# EAGLE design Sensorino-SMD (EAGLE 6.4)
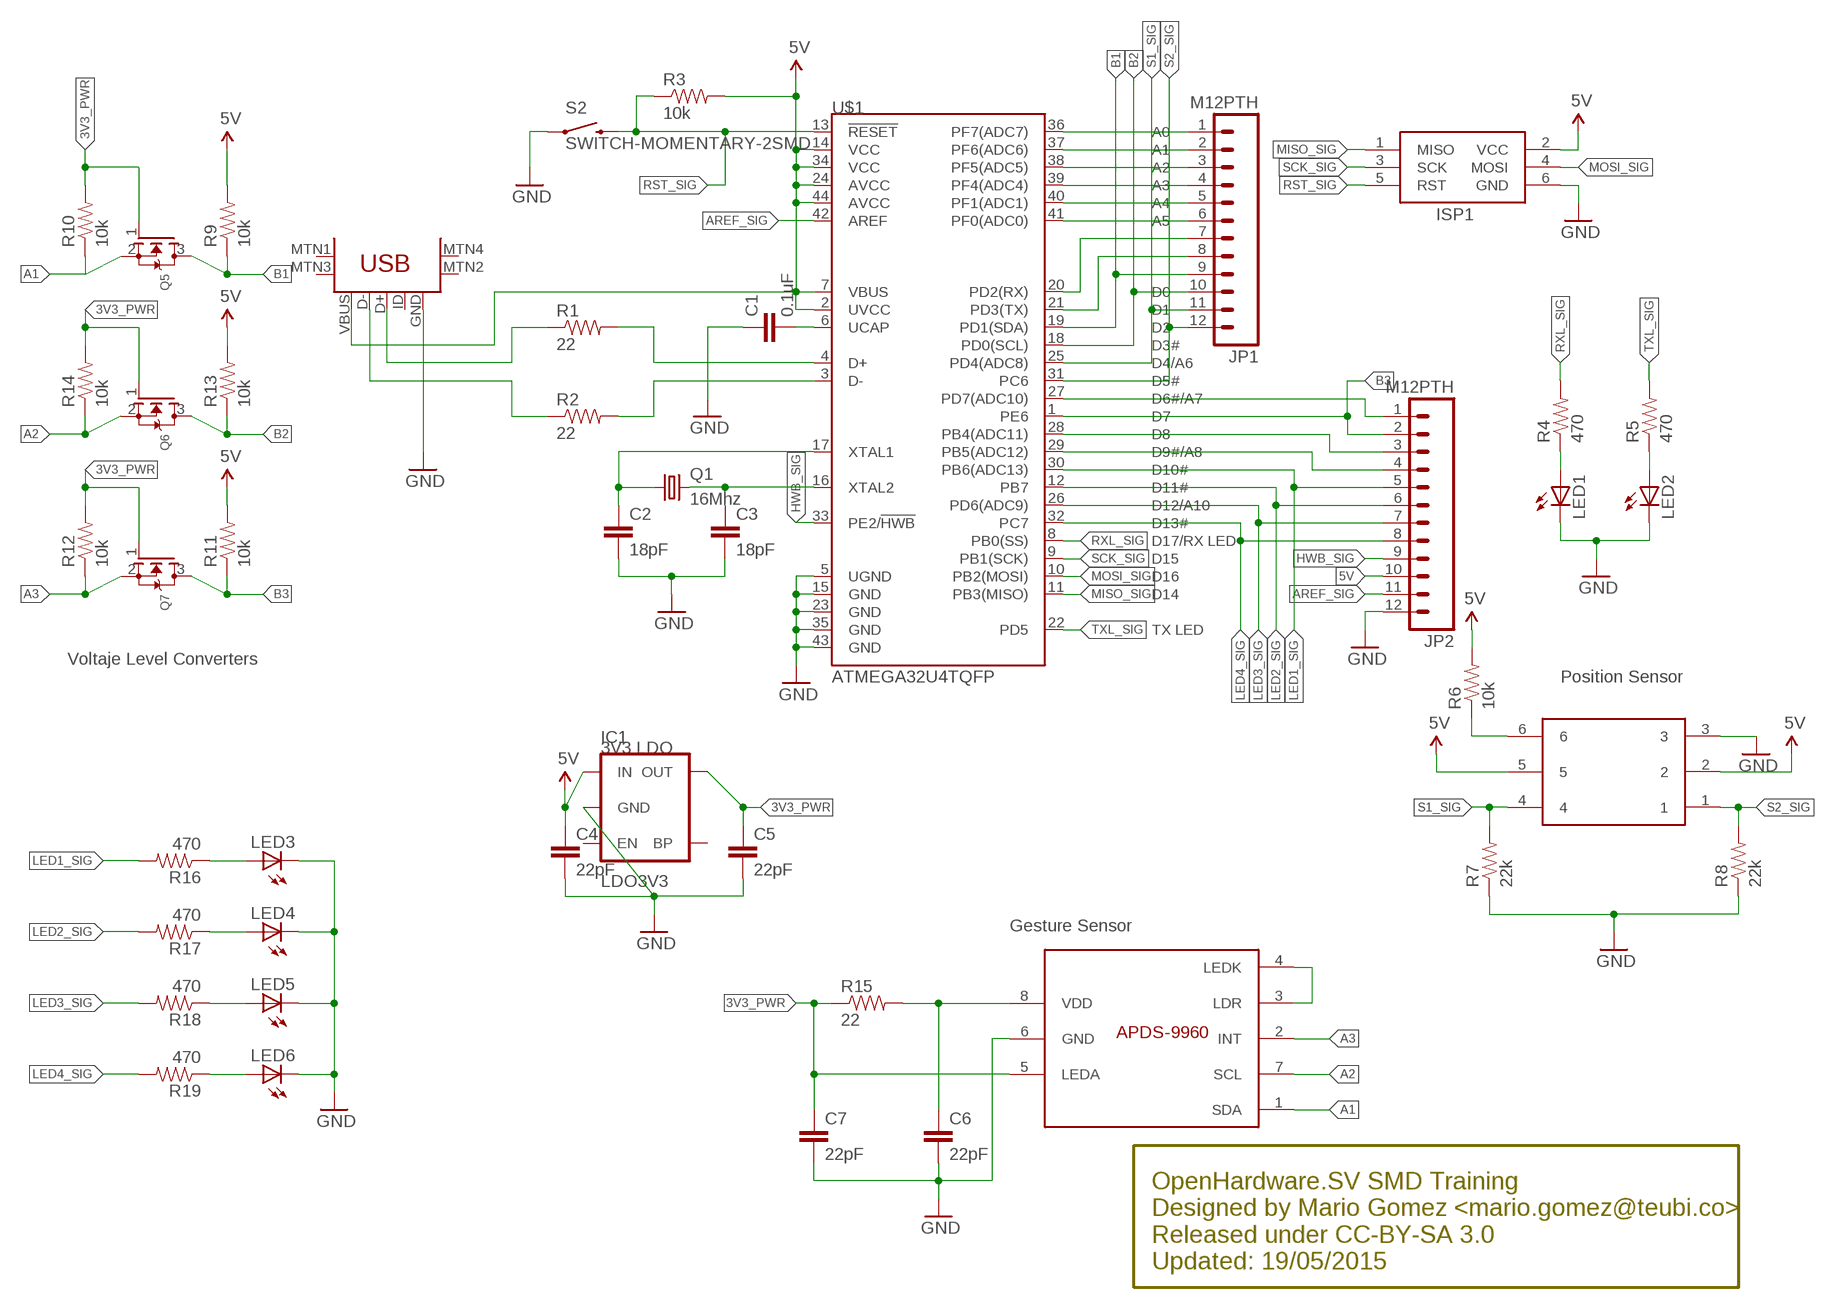
[diagram p0: schematic, sheet 1]

## Parts
C1  0.1uF  CAP0805  [0805]
C2  18pF  CAP0805  [0805]
C3  18pF  CAP0805  [0805]
C4  22pF  CAP0805  [0805]
C5  22pF  CAP0805  [0805]
C6  22pF  CAP0805  [0805]
C7  22pF  CAP0805  [0805]
IC1  LDO3V3  MIC52053.3V  [SOT23-5]
ISP1  AVRISP-6  [AVRISP]
JP1  M12PTH  [1X12]
JP2  M12PTH  [1X12]
LED1  LED-WHITE  [LED-1206]
LED2  LED-WHITE  [LED-1206]
LED3  LED-WHITE  [LED-1206]
LED4  LED-WHITE  [LED-1206]
LED5  LED-WHITE  [LED-1206]
LED6  LED-WHITE  [LED-1206]
Q1  16Mhz  CRYSTALCTS406  [CTS406]
Q5  MOSFET-NREFLOW  [SOT23]
Q6  MOSFET-NREFLOW  [SOT23]
Q7  MOSFET-NREFLOW  [SOT23]
R1  22  RESISTOR0805-RES  [0805]
R2  22  RESISTOR0805-RES  [0805]
R3  10k  RESISTOR0805-RES  [0805]
R4  470  RESISTOR0805-RES  [0805]
R5  470  RESISTOR0805-RES  [0805]
R6  10k  RESISTOR0805-RES  [0805]
R7  22k  RESISTOR0805-RES  [0805]
R8  22k  RESISTOR0805-RES  [0805]
R9  10k  RESISTOR0805-RES  [0805]
R10  10k  RESISTOR0805-RES  [0805]
R11  10k  RESISTOR0805-RES  [0805]
R12  10k  RESISTOR0805-RES  [0805]
R13  10k  RESISTOR0805-RES  [0805]
R14  10k  RESISTOR0805-RES  [0805]
R15  22  RESISTOR0805-RES  [0805]
R16  470  RESISTOR0805-RES  [0805]
R17  470  RESISTOR0805-RES  [0805]
R18  470  RESISTOR0805-RES  [0805]
R19  470  RESISTOR0805-RES  [0805]
S2  SWITCH-MOMENTARY-2SMD  [TACTILE_SWITCH_SMD]
U$1  ATMEGA32U4TQFP  [SPARKFUN-DIGITALIC_TQFP44]
U$2  USB-MINIB-5PIN  [USB-MINIB]
U$3  RPI-1031  [RPI-1031]
U$4  APDS-9960  [APDS-9960]

## Nets
3V3_PWR: C5.1 C7.1 IC1.5(OUT) Q5.1(G) Q6.1(G) Q7.1(G) R10.2 R12.2 R14.2 R15.1 U$4.5(LEDA)
5V: C4.1 IC1.1(IN) ISP1.2(VCC) JP2.10 R3.2 R6.2 R9.2 R11.2 R13.2 U$1.2(UVCC) U$1.7(VBUS) U$1.14(VCC) U$1.24(AVCC) U$1.34(VCC) U$1.44(AVCC) U$2.VBUS U$3.2 U$3.5
A1: Q5.2(S) R10.1 U$4.1(SDA)
A2: Q6.2(S) R14.1 U$4.7(SCL)
A3: Q7.2(S) R12.1 U$4.2(INT)
AREF_SIG: JP2.11 U$1.42(AREF)
B1: JP1.9 Q5.3(D) R9.1 U$1.19(PD1(SDA))
B2: JP1.10 Q6.3(D) R13.1 U$1.18(PD0(SCL))
B3: JP2.2 Q7.3(D) R11.1 U$1.1(PE6)
D_USBD+: R2.1 U$2.D-
D_USBD-: R1.1 U$2.D+
D_USBRD+: R2.2 U$1.3(D-)
D_USBRD-: R1.2 U$1.4(D+)
GND: C1.1 C2.2 C3.2 C4.2 C5.2 C6.2 C7.2 IC1.2(GND) ISP1.6(GND) JP2.12 LED1.C LED2.C LED3.C LED4.C LED5.C LED6.C R7.1 R8.1 S2.1 U$1.5(UGND) U$1.15(GND) U$1.23(GND) U$1.35(GND) U$1.43(GND) U$2.GND U$3.3 U$4.6(GND)
HWB_SIG: JP2.9 U$1.33(PE2/!HWB)
LED1_SIG: JP2.5 R16.2 U$1.30(PB6(ADC13))
LED2_SIG: JP2.6 R17.2 U$1.12(PB7)
LED3_SIG: JP2.7 R18.2 U$1.26(PD6(ADC9))
LED4_SIG: JP2.8 R19.2 U$1.32(PC7)
MISO_SIG: ISP1.1(MISO) U$1.11(PB3(MISO))
MOSI_SIG: ISP1.4(MOSI) U$1.10(PB2(MOSI))
N$5: JP2.1 U$1.27(PD7(ADC10))
N$6: C1.2 U$1.6(UCAP)
N$7: C3.1 Q1.3 U$1.16(XTAL2)
N$8: C2.1 Q1.1 U$1.17(XTAL1)
N$9: LED3.A R16.1
N$10: JP2.3 U$1.28(PB4(ADC11))
N$11: LED1.A R4.1
N$12: LED2.A R5.1
N$13: JP1.1 U$1.36(PF7(ADC7))
N$14: JP1.2 U$1.37(PF6(ADC6))
N$15: JP1.3 U$1.38(PF5(ADC5))
N$16: JP1.4 U$1.39(PF4(ADC4))
N$17: JP1.5 U$1.40(PF1(ADC1))
N$18: JP1.6 U$1.41(PF0(ADC0))
N$19: JP1.7 U$1.20(PD2(RX))
N$20: JP1.8 U$1.21(PD3(TX))
N$21: LED4.A R17.1
N$22: LED5.A R18.1
N$23: LED6.A R19.1
N$25: JP2.4 U$1.29(PB5(ADC12))
N$30: R6.1 U$3.6
N$31: U$4.3(LDR) U$4.4(LEDK)
N$32: C6.1 R15.2 U$4.8(VDD)
RST_SIG: ISP1.5(RST) R3.1 S2.3 U$1.13(!RESET)
RXL_SIG: R4.2 U$1.8(PB0(SS))
S1_SIG: JP1.11 R7.2 U$1.25(PD4(ADC8)) U$3.4
S2_SIG: JP1.12 R8.2 U$1.31(PC6) U$3.1
SCK_SIG: ISP1.3(SCK) U$1.9(PB1(SCK))
TXL_SIG: R5.2 U$1.22(PD5)
Unconnected: IC1.3(EN) IC1.4(BP) U$2.ID U$2.MTN1(MTN2) U$2.MTN2(MTN3) U$2.MTN3(MTN1) U$2.MTN4

## Notes on the sheet
- Voltaje Level Converters
- Position Sensor
- 3V3 LDO
- Gesture Sensor
- OpenHardware.SV SMD Training
  Designed by Mario Gomez <mario.gomez@teubi.co>
  Released under CC-BY-SA 3.0
  Updated: 19/05/2015

## Library data of the parts
C1-C7 = SparkFun-Capacitors:CAP: Capacitor Standard 0603 ceramic capacitor, and 0.1" leaded capacitor.
IC1 = SparkFun-PowerIC:MIC5205: MIC5205 150mA vreg 3.3V - VREG-00822 5V - VREG-00823; PROD_ID: VREG-00822
ISP1 = adafruit:AVRISP: AVR ISP HEADER Standard 6 pin header for AVR programming
JP1 JP2 = SparkFun-Connectors:M12: Header 12 Standard 12-pin 0.1" header. Use with straight break away headers (SKU : PRT-00116), right angle break away headers (PRT-00553), swiss pins (PRT-00743), machine pins (PRT-00117), and female headers (PRT-00115).
LED1-LED6 = SparkFun-LED:LED-WHITE: White SMD LEDs LilyPad 1206- DIO-09955; PROD_ID: DIO-09955; VALUE: WHITE
Q1 = adafruit:CRYSTAL: CRYSTAL; OC_FARNELL: unknown; OC_NEWARK: unknown
Q5-Q7 = adafruit:MOSFET-N: N-Channel Mosfet 2N7002E - 60V 260mA SOT23 [Digikey: 2N7002ET1GOSTR-ND] - REEL BSH103 - 30V 850mA SOT23 [Digikey: 568-5013-1-ND]
R1-R19 = SparkFun-Resistors:RESISTOR: Resistor Basic schematic elements and footprints for 0603, 1206, and PTH resistors.
S2 = SparkFun-Electromechanical:SWITCH-MOMENTARY-2: Various NO switches- pushbuttons, reed, etc
U$1 = SparkFun-DigitalIC:ATMEGA32U4: Atmel 44-pin 8-bit Microcontroller with 32KBytes of ISP Flash and USB Controller ----- Please use the QFN-44-NOPAD_1:1 package for the footprint of all boards using a 32U4. Route traces directly away from the pads as much as possible.
U$2 = SparkFun-Connectors:USB-MINIB: Mini-USB "B" connector with 5th pin broken out. Created new symbol breaking out 5th "ID" pin in mini/micro USB connector spec. See: http://en.wikipedia.org/wiki/Mini_usb#Cables. Uses same footprint as 4-pin symbol. Also added pins to connect to mounting / shield pads if required (probably not generally needed as signals aren't shielded once they leave the connector).
U$3 = custom_components:RPI-1031
U$4 = custom_components:APDS-9960

## Board
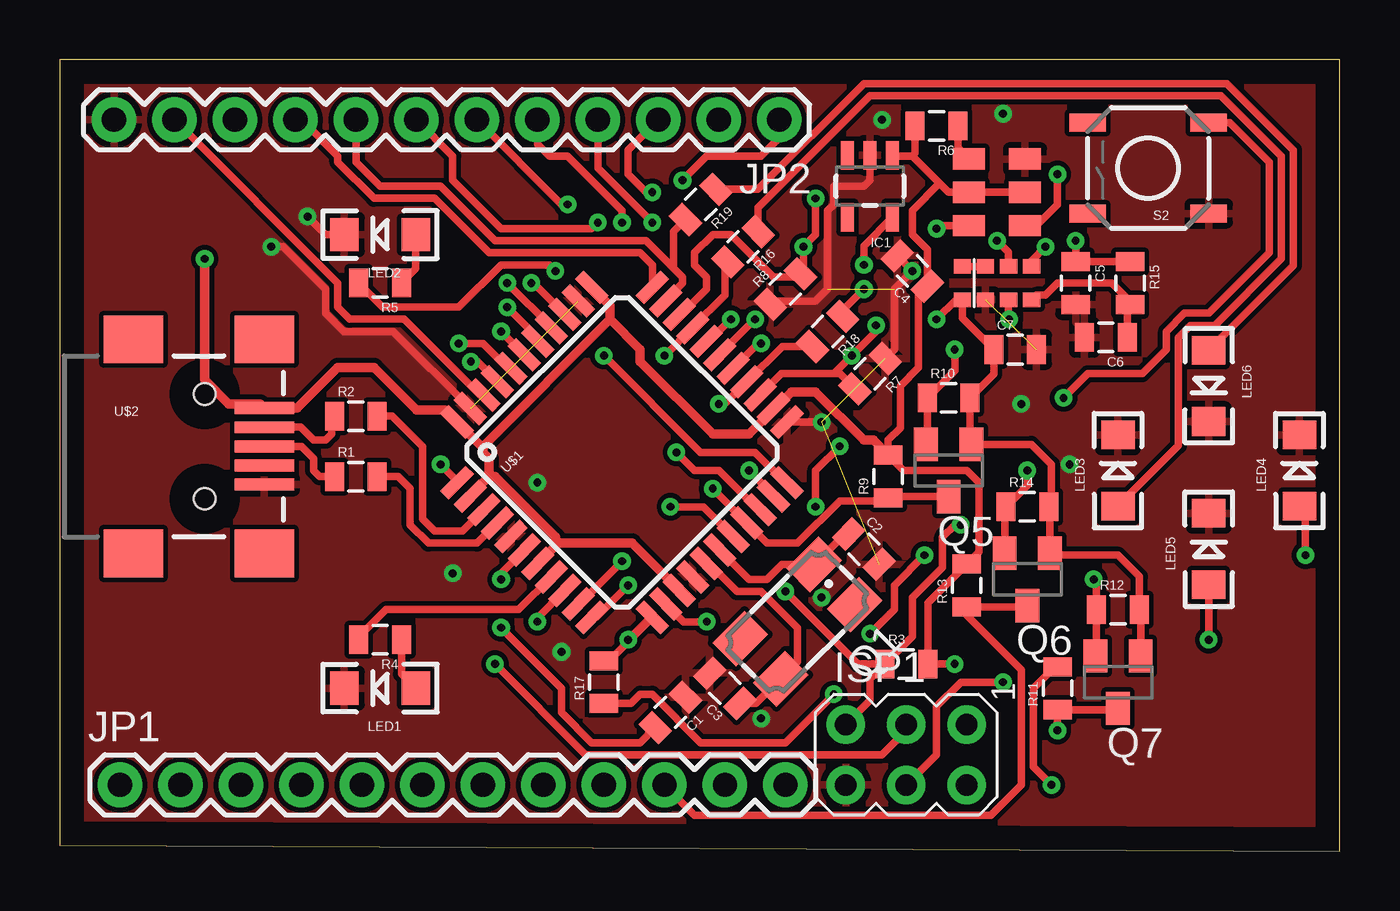
[diagram p1: board, top side]
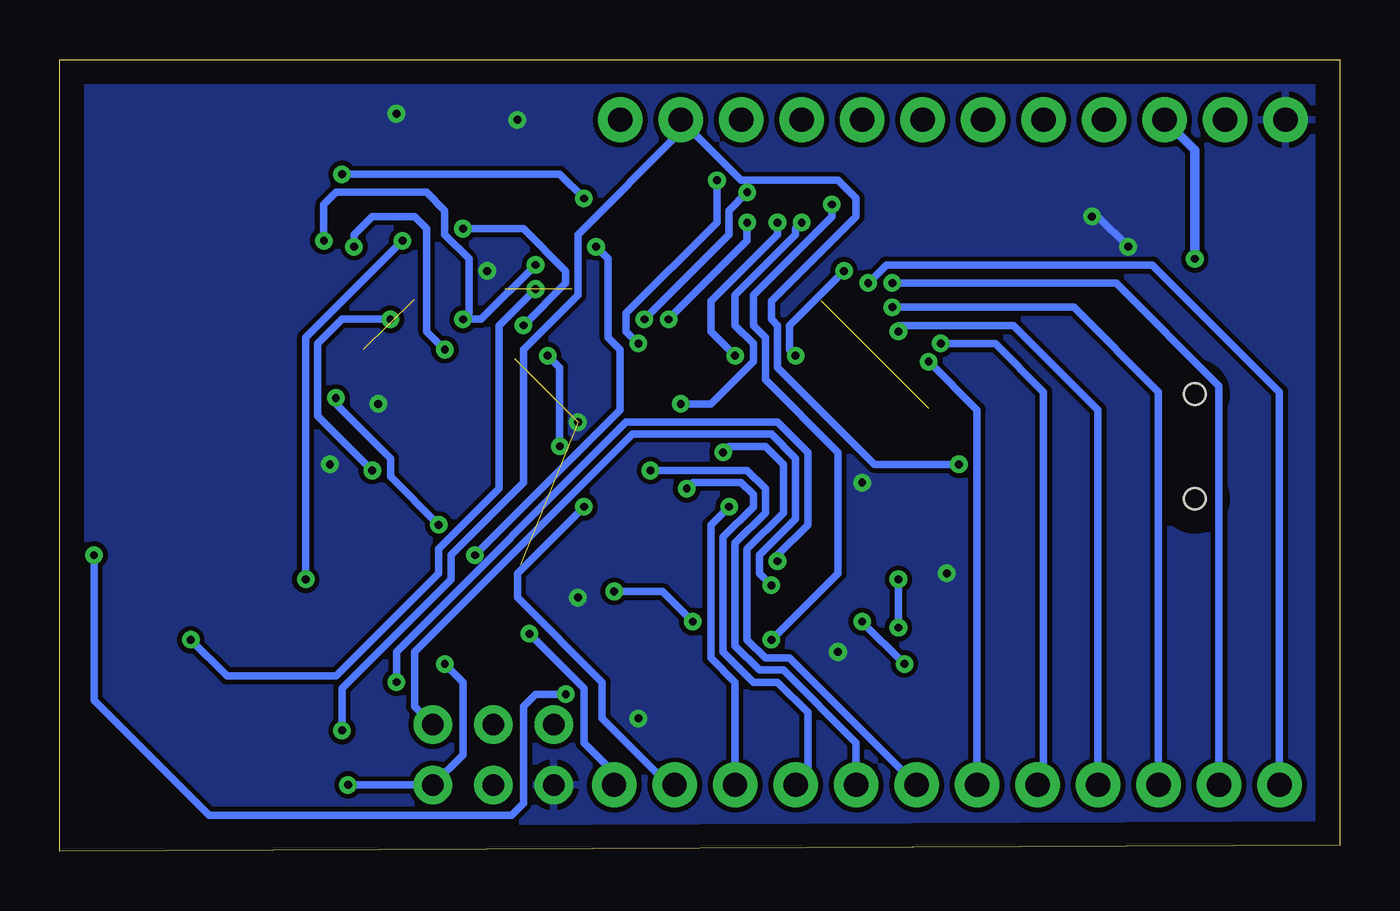
[diagram p2: board, bottom side, seen from below]

Size 53.77 x 33.26 mm. Coordinates in mm from the lower left corner, seen from the top.
Outline: 0,0.25 53.77,0 53.77,33.26 0,33.26 0,0.25
Copper layers (1*16): Top 0.035mm / dielectric 1.5mm / Bottom 0.035mm
Design rules "default": minimum track width 10mil, minimum drill 24mil, track to track 8mil, track to pad 8mil, pad to pad 8mil, via to via 8mil, smd to smd 8mil, copper to edge 40mil, drill to drill 8mil, minimum pad ring 10mil, minimum via ring 8mil, stop-mask expansion 4mil, vias tented up to drill 0mil, thermal gap 10mil

### Footprints (pad centres in the part's own frame; a part is rotated, then mirrored left to right if it is on the bottom)
0805 = smd 0.8 x 1.2: 1 -0.9,0; 2 0.9,0
SOT23-5 = smd 0.55 x 1.2: 1 -0.95,-1.3; 2 0,-1.3; 3 0.95,-1.3; 4 0.95,1.3; 5 -0.95,1.3
AVRISP = drill 0.9 pad 1.626: 1 -1.27,2.54; 2 1.27,2.54; 3 -1.27,0; 4 1.27,0; 5 -1.27,-2.54; 6 1.27,-2.54
1X12 = drill 1.016 pad 1.88: 1 0,0; 2 2.54,0; 3 5.08,0; 4 7.62,0; 5 10.16,0; 6 12.7,0; 7 15.24,0; 8 17.78,0; 9 20.32,0; 10 22.86,0; 11 25.4,0; 12 27.94,0
LED-1206 = smd 1.2 x 1.4: A -1.5,0; C 1.5,0
CTS406 = smd 1.9 x 1.4: 1 -2.2,-1.2; 2 2.2,-1.2; 3 2.2,1.2; 4 -2.2,1.2
SOT23 = smd 1 x 1.4: 1 -0.95,-1.1; 2 0.95,-1.1; 3 0,1.1
TACTILE_SWITCH_SMD = smd 1.524 x 0.762: 1 -2.54,1.905; 2 2.54,1.905; 3 -2.54,-1.905; 4 2.54,-1.905
SPARKFUN-DIGITALIC_TQFP44 = smd 1.5 x 0.5: 1 -5.8,4; 2 -5.8,3.2; 3 -5.8,2.4; 4 -5.8,1.6; 5 -5.8,0.8; 6 -5.8,0; 7 -5.8,-0.8; 8 -5.8,-1.6; 9 -5.8,-2.4; 10 -5.8,-3.2; 11 -5.8,-4; 23 5.8,-4; 24 5.8,-3.2; 25 5.8,-2.4; 26 5.8,-1.6; 27 5.8,-0.8; 28 5.8,0; 29 5.8,0.8; 30 5.8,1.6; 31 5.8,2.4; 32 5.8,3.2; 33 5.8,4 | smd 0.5 x 1.5: 12 -4,-5.8; 13 -3.2,-5.8; 14 -2.4,-5.8; 15 -1.6,-5.8; 16 -0.8,-5.8; 17 0,-5.8; 18 0.8,-5.8; 19 1.6,-5.8; 20 2.4,-5.8; 21 3.2,-5.8; 22 4,-5.8; 34 4,5.8; 35 3.2,5.8; 36 2.4,5.8; 37 1.6,5.8; 38 0.8,5.8; 39 0,5.8; 40 -0.8,5.8; 41 -1.6,5.8; 42 -2.4,5.8; 43 -3.2,5.8; 44 -4,5.8
USB-MINIB = smd 2.5 x 0.5: D+ 2.5,0; D- 2.5,0.8; GND 2.5,-1.6; ID 2.5,-0.8; VBUS 2.5,1.6 | smd 2.5 x 2: MTN1 -3,4.5; MTN2 2.5,4.5; MTN3 -3,-4.5; MTN4 2.5,-4.5 | hole 0.9: 0,2.2; 0,-2.2
RPI-1031 = smd 1.35 x 0.9: 1 1.175,-1.4; 2 1.175,0; 3 1.175,1.4; 4 -1.175,-1.4; 5 -1.175,0; 6 -1.175,1.4
APDS-9960 = smd 0.6 x 0.72: 1 -0.7,1.455; 2 -0.7,0.485; 3 -0.7,-0.485; 4 -0.7,-1.455; 5 0.7,-1.455; 6 0.7,-0.485; 7 0.7,0.485; 8 0.7,1.455

### Placement (x,y rotation side)
C1  25.65,5.84 225 top
C2  33.78,12.7 315 top
C3  27.94,6.86 135 top
C4  35.81,24.38 135 top
C5  42.67,23.88 270 top
C6  43.94,21.59 180 top
C7  40.13,21.08 0 top
IC1  34.04,27.94 180 top
ISP1  35.56,4.06 270 top
JP1  2.54,2.79 0 top
JP2  30.23,30.73 180 top
LED1  13.46,6.86 180 top
LED2  13.46,25.91 180 top
LED3  44.45,16 90 top
LED4  52.07,16 90 top
LED5  48.26,12.7 90 top
LED6  48.26,19.56 270 top
Q1  30.99,9.65 225 top
Q5  37.34,16 180 top
Q6  40.64,11.43 180 top
Q7  44.45,7.11 180 top
R1  12.45,15.75 0 top
R2  12.45,18.29 0 top
R3  35.56,7.87 0 top
R4  13.46,8.89 180 top
R5  13.46,23.88 180 top
R6  36.83,30.48 180 top
R7  34.04,20.07 225 top
R8  30.48,23.62 45 top
R9  34.8,15.75 90 top
R10  37.34,19.05 0 top
R11  41.91,6.86 90 top
R12  44.45,10.16 0 top
R13  38.1,11.18 90 top
R14  40.64,14.48 0 top
R15  44.96,23.88 270 top
R16  28.7,25.4 225 top
R17  22.86,7.11 90 top
R18  32.26,21.84 225 top
R19  26.92,27.18 225 top
S2  45.72,28.7 180 top
U$1  23.62,16.76 45 top
U$2  6.1,17.02 0 top
U$3  39.37,27.69 0 top
U$4  39.37,23.88 270 top

### Tracks (layer width: path | path; a pad name or v marks a point on that pad's centre or on a via)
3V3_PWR  (via drill 0.33)
  Top 0.305: Q7.1 45.4,10.11 R12.2 45.35,11.55 44.45,12.45 41.67,12.45 Q6.1 41.59,14.43 R14.2 41.66,14.59 41.66,16.26 40.81,17.1 Q5.1 38.24,17.15 R10.2 39.23,20.04 C7.1 37.91,22.4 U$4.5 37.65,23.18 v36.83,22.35 | v33.78,24.64 33.78,25.44 IC1.5 | R15.1 C5.1 v42.67,25.65
  Bottom 0.305: v33.78,24.64 36.07,22.35 v36.83,22.35 36.58,22.61 36.58,24.89 37.59,25.91 37.59,26.92 38.35,27.69 42.16,27.69 42.67,27.18 v42.67,25.65
5V  (via drill 0.33)
  Top 0.305: v37.59,7.87 R3.2 36.46,10.44 R13.2 38.61,12.58 38.61,15.49 38.1,16 35.44,16 R9.2 34.8,17.27 35.31,17.78 35.31,19.56 36.07,20.32 36.07,23.37 C4.1 36.45,25.27 35.81,25.91 35.81,26.92 36.96,28.07 | 36.96,28.07 37.34,27.69 U$3.5 U$3.2 | 36.96,28.07 35.81,29.21 | 35.81,29.21 35.02,29.21 IC1.1 | R6.2 35.93,29.33 35.81,29.21 | R11.2 41.79,7.76 40.89,6.86 40.89,3.56 v41.66,2.79
  Top 0.406: U$1.2 17.26,14.97 18.03,15.75 | 18.03,15.75 18.03,16.51 17.78,16.76 17.78,16.95 | 17.78,16.95 U$1.44 16.19,18.54 14.99,18.54 13.21,20.32 11.68,20.32 9.98,18.62 U$2.VBUS 8.42,18.8 7.11,18.8 6.1,19.81 v6.1,24.89 | U$1.34 23.11,22.93 23.11,22.35 | 23.11,22.35 17.78,17.02 17.78,16.95 | U$1.7 20.83,12.84 20.83,12.95 | 20.83,12.95 20.83,13.21 18.29,15.75 18.03,15.75 | U$1.14 24.04,12.95 20.83,12.95 | 23.11,22.35 24.38,21.08 24.38,20.57 27.43,17.53 28.96,17.53 29.99,18.56 U$1.24 30.03,18.6 30.73,19.3 31.75,19.3 33.78,17.27 34.17,17.27 R9.2
  Bottom 0.305: v37.59,7.87 36.83,7.11 36.83,4.06 ISP1.2 v41.66,2.79
  Bottom 0.406: JP2.10 6.1,29.46 v6.1,24.89
A1  (via drill 0.33)
  Top 0.305: Q5.2 36.44,17.15 R10.1 37.59,20.2 v37.59,21.08 | v41.4,25.4 40.83,24.82 U$4.1
  Bottom 0.305: v37.59,21.08 38.35,21.84 38.35,26.16 38.86,26.67 40.64,26.67 41.4,25.91 v41.4,25.4
A2  (via drill 0.33)
  Top 0.305: Q6.2 39.69,14.43 R14.1 40.64,15.38 v40.64,16 | v39.88,22.35 39.85,22.38 U$4.7
  Bottom 0.305: v40.64,16 42.93,18.29 42.93,21.34 41.91,22.35 v39.88,22.35
A3  (via drill 0.33)
  Top 0.305: Q7.2 43.55,8.26 R12.1 43.55,11.31 v43.43,11.43 | v39.37,25.65 39.85,25.17 U$4.2
  Bottom 0.305: v43.43,11.43 43.43,21.59 v39.37,25.65
AREF_SIG
  Top 0.305: JP2.11 11.68,23.88 11.68,22.86 12.19,22.35 14.48,22.35 17.66,19.17 U$1.42
B1  (via drill 0.33)
  Top 0.305: Q5.3 34.85,14.9 R9.1 34.68,14.73 32.77,14.73 30.99,12.95 29.72,12.95 28.88,13.79 U$1.19 27.43,15.22 v27.43,15.24
  Bottom 0.305: JP1.9 22.35,3.3 22.35,5.84 23.62,7.11 24.64,7.11 25.91,8.38 25.91,13.21 24.64,14.48 24.64,14.99 25.15,15.49 27.18,15.49 v27.43,15.24
B2  (via drill 0.33)
  Top 0.305: Q6.3 40.59,10.28 R13.1 38.1,9.91 40.39,7.62 40.39,2.79 39.12,1.52 26.67,1.52 JP1.10 | v25.65,14.48 27.04,14.48 U$1.18
  Bottom 0.305: JP1.10 25.4,7.11 26.42,8.13 26.42,13.72 v25.65,14.48
B3  (via drill 0.33)
  Top 0.305: v16,16.26 16.69,15.57 U$1.1 | Q7.3 44.4,5.96 R11.1 v41.91,5.08
  Bottom 0.305: v16,16.26 19.56,16.26 23.62,20.32 23.62,22.1 23.88,22.35 23.88,23.11 20.32,26.67 20.32,27.43 21.08,28.19 25.15,28.19 JP2.2 27.69,30.23 32,25.91 32,23.37 34.29,21.08 34.29,15.49 37.34,12.45 37.34,11.43 41.91,6.86 v41.91,5.08
D_USBD+
  Top 0.305: U$2.D- 10.12,17.82 10.67,17.27 11.18,17.27 11.43,17.53 11.43,18.17 R2.1
D_USBD-
  Top 0.305: R1.1 10.92,15.75 10.67,16 10.67,16.51 10.16,17.02 U$2.D+
D_USBRD+
  Top 0.305: R2.2 13.97,18.29 15.24,17.02 15.24,13.97 15.75,13.46 16.93,13.46 U$1.3
D_USBRD-
  Top 0.305: U$1.4 18.37,13.79 17.53,12.95 15.49,12.95 14.73,13.72 14.73,15.24 14.22,15.75 R1.2 13.46,15.63
GND  (via drill 0.33)  (5 unrouted)
  Top 0.305: U$1.43 14.02,21.84 11.94,21.84 11.18,22.61 11.18,23.62 9.4,25.4 v8.89,25.4 | v10.41,26.67 11.18,25.91 LED2.C | R7.1 35.05,21.08 35.05,23.62 v35.81,24.38 | C4.2 v35.81,24.38 | v35.81,24.38 | U$1.23 v32,18.03 | R8.1 29.97,23.11 31.75,23.11 32.26,23.62 32.26,26.92 32.51,27.18 32.51,27.94 33.78,27.94 34.04,28.19 IC1.2
  Bottom 0.305: v8.89,25.4 10.16,26.67 v10.41,26.67
  other vias: 34.54,30.73 40.39,18.8 42.42,16.26 29.46,5.59 20.07,15.49 16.51,11.68 32,10.67 39.62,30.99 21.08,8.38
  pour Top: 0,0.25 53.85,0.25 53.85,33.27 0,33.27
  pour Bottom: 0,0.25 53.85,0.25 53.85,33.27 0,33.27
HWB_SIG
  Top 0.305: U$1.33 24.89,24.64 24.38,25.15 18.03,25.15 15.75,27.43 13.21,27.43 11.68,28.96 11.68,29.21 10.16,30.73 JP2.9
LED1_SIG  (via drill 0.33)
  Top 0.305: R16.2 27.94,24.64 27.94,23.37 26.59,22.02 U$1.30 25.42,20.83 v25.4,20.83 | v23.62,26.42 23.62,26.92 21.34,29.21 20.57,29.21 20.07,29.72 JP2.5
  Bottom 0.305: v25.4,20.83 26.42,21.84 26.42,23.11 23.62,25.91 v23.62,26.42
LED2_SIG  (via drill 0.33)
  Top 0.305: v23.88,8.89 24.82,9.83 U$1.12 23.07,8.01 R17.2 | JP2.6 21.08,27.18 v21.34,27.18
  Bottom 0.305: v21.34,27.18 21.34,26.67 24.64,23.37 24.64,22.1 24.13,21.59 24.13,19.81 21.08,16.76 21.08,11.68 v23.88,8.89
LED3_SIG  (via drill 0.33)
  Top 0.305: JP2.7 16.51,29.21 16.51,28.19 18.54,26.16 22.35,26.16 v22.61,26.42 | v27.69,18.8 27.92,18.8 U$1.26 28.88,19.73 30.35,21.21 R18.2
  Bottom 0.305: v22.61,26.42 22.86,26.16 22.86,25.91 25.4,23.37 25.4,22.1 24.64,21.34 24.64,20.57 26.42,18.8 v27.69,18.8
LED4_SIG
  Top 0.305: JP2.8 12.45,28.96 13.46,27.94 16,27.94 18.29,25.65 24.64,25.65 25.78,24.51 | 25.78,24.51 26.16,24.13 26.16,23.88 25.46,23.17 U$1.32 | R19.2 25.78,26.04 25.78,24.51
MISO_SIG  (via drill 0.33)
  Top 0.305: U$1.11 22.53,9.83 v23.88,11.18
  Bottom 0.305: ISP1.1 38.86,6.1 38.86,8.38 29.72,17.53 23.88,17.53 22.86,16.51 22.86,13.97 24.38,12.45 24.38,11.68 v23.88,11.18
MOSI_SIG  (via drill 0.33)
  Top 0.305: U$1.10 21.83,10.4 v23.62,12.19 | v39.62,7.11 37.85,7.11 36.83,6.1 36.83,4.06 ISP1.4
  Bottom 0.305: v39.62,7.11 39.62,8.38 29.97,18.03 23.62,18.03 22.35,16.76 22.35,13.72 23.62,12.45 v23.62,12.19
N$5  (via drill 0.33)
  Top 0.305: U$1.27 29.32,21.34 v29.46,21.34 | v26.16,28.19 27.18,29.21 29.46,29.21 30.23,29.97 JP2.1
  Bottom 0.305: v29.46,21.34 29.97,21.84 29.97,22.61 26.16,26.42 v26.16,28.19
N$6  (via drill 0.33)
  Top 0.305: v18.54,9.4 21.08,6.86 21.08,5.84 22.35,4.57 24.38,4.57 C1.2 | v18.54,11.43 18.54,11.68 U$1.6
  Bottom 0.305: v18.54,9.4 v18.54,11.43
N$7
  Top 0.305: C3.1 29.25,6.22 Q1.3 30.99,7.96 30.99,9.4 29.46,10.92 28.45,10.92 27.27,12.1 U$1.16
N$8
  Top 0.305: C2.1 32.98,13.34 Q1.1 30.34,12.06 29.72,11.43 28.96,11.43 U$1.17
N$9
  Top 0.305: R16.1 29.34,27.05 34.04,31.75 48.77,31.75 51.31,29.21 51.31,24.89 48.51,22.1 47.5,22.1 46.99,21.59 46.99,17.04 LED3.A
N$10  (via drill 0.33)
  Top 0.305: JP2.3 23.88,29.46 23.88,28.45 24.64,27.69 v24.89,27.69 | v29.21,22.35 U$1.28
  Bottom 0.305: v24.89,27.69 25.65,26.92 25.65,25.91 v29.21,22.35
N$11
  Top 0.305: R4.1 14.36,7.46 LED1.A
N$12
  Top 0.305: R5.1 14.96,24.48 LED2.A
N$13  (via drill 0.33)
  Top 0.305: U$1.36 19.9,23.88 v19.81,23.88
  Bottom 0.305: v19.81,23.88 19.05,24.64 7.87,24.64 2.54,19.3 JP1.1
N$14  (via drill 0.33)
  Top 0.305: U$1.37 20.65,22.02 v18.8,23.88
  Bottom 0.305: v18.8,23.88 9.4,23.88 5.08,19.56 JP1.2
N$15  (via drill 0.33)
  Top 0.305: U$1.38 20.09,21.57 v18.8,22.86
  Bottom 0.305: v18.8,22.86 11.18,22.86 7.62,19.3 JP1.3
N$16  (via drill 0.33)
  Top 0.305: U$1.39 | U$1.39 v18.54,21.84
  Bottom 0.305: v18.54,21.84 18.54,22.1 13.72,22.1 10.16,18.54 JP1.4
N$17  (via drill 0.33)
  Top 0.305: U$1.40 18.82,20.3 17.78,21.34 v16.76,21.34
  Bottom 0.305: v16.76,21.34 14.48,21.34 12.45,19.3 12.45,3.05 JP1.5
N$18  (via drill 0.33)
  Top 0.305: v17.27,20.57 17.55,20.57 U$1.41
  Bottom 0.305: JP1.6 15.24,18.54 v17.27,20.57
N$19  (via drill 0.33)
  Top 0.305: v25.91,16.76 26.67,16 27.69,16 29.33,14.36 U$1.20
  Bottom 0.305: JP1.7 23.11,8.13 24.13,8.13 24.89,8.89 24.89,12.7 23.37,14.22 23.37,16.26 24.13,17.02 25.65,17.02 v25.91,16.76
N$20  (via drill 0.33)
  Top 0.305: v28.96,16 29.99,14.97 U$1.21
  Bottom 0.305: JP1.8 20.32,4.57 23.37,7.62 24.38,7.62 25.4,8.64 25.4,12.95 24.13,14.22 24.13,15.24 24.89,16 v28.96,16
N$21  (via drill 0.33)
  Top 0.305: R17.1 23.99,6.21 24.38,6.6 24.89,6.6 26.92,4.57 30.48,4.57 v32.51,6.6 | v52.32,12.45 52.32,14.25 LED4.A
  Bottom 0.305: v32.51,6.6 33.78,6.6 34.29,6.1 34.29,2.03 34.8,1.52 47.5,1.52 52.32,6.35 v52.32,12.45
N$22  (via drill 0.33)
  Top 0.305: R18.1 32.89,22.73 v33.78,23.62 | v48.26,8.89 LED5.A
  Bottom 0.305: v48.26,8.89 46.74,7.37 42.16,7.37 37.85,11.68 37.85,12.7 35.31,15.24 35.31,22.1 v33.78,23.62
N$23
  Top 0.305: R19.1 29.34,27.81 33.78,32.26 49.02,32.26 51.82,29.46 51.82,24.61 LED6.A
N$25  (via drill 0.33)
  Top 0.305: U$1.29 27.27,21.43 v28.19,22.35 | v24.89,26.42 22.61,28.7 JP2.4
  Bottom 0.305: v28.19,22.35 24.89,25.65 v24.89,26.42
N$30
  Top 0.305: U$3.6 37.73,29.55 R6.1
N$31
  Top 0.305: U$4.4 U$4.3
N$32
  Top 0.305: C6.1 44.84,22.86 R15.2 44.96,23.11 44.2,23.88 41.91,23.88 41.4,23.37 41.02,23.37 U$4.8
RST_SIG  (via drill 0.33)
  Top 0.305: ISP1.5 34.04,6.35 34.04,7.25 R3.1 | R3.1 33.53,7.87 v30.48,10.92 | v27.18,9.65 26.21,9.65 U$1.13 | R3.1 35.81,9.03 35.81,10.67 37.08,11.94 37.08,13.21 37.59,13.72 v37.85,13.72 | v42.16,19.05 43.18,20.07 45.47,20.07 46.48,21.08 46.48,21.84 47.24,22.61 48.26,22.61 50.8,25.15 50.8,28.96 49.15,30.61 S2.3
  Bottom 0.305: v30.48,10.92 28.45,10.92 v27.18,9.65 | v37.85,13.72 39.88,15.75 39.88,16.51 42.16,18.8 v42.16,19.05
RXL_SIG
  Top 0.305: R4.2 12.56,9.01 13.72,10.16 19.28,10.16 U$1.8
S1_SIG  (via drill 0.33)
  Top 0.305: U$1.25 30.32,20.07 32.51,20.07 | 32.51,20.07 32.77,20.07 R7.2 | v31.75,14.48 31.75,16 v32.77,17.02 | 32.51,20.07 v33.27,20.83 34.29,21.84 v34.29,22.1 | U$3.4 36.95,26.29 v36.83,26.16
  Bottom 0.305: JP1.11 28.19,2.79 30.99,5.59 30.99,7.11 34.54,10.67 34.54,11.68 v31.75,14.48 | v32.77,17.02 32.77,20.32 v33.27,20.83 | v36.83,26.16 34.29,26.16 32.51,24.38 32.51,23.88 v34.29,22.1
S2_SIG  (via drill 0.33)
  Top 0.305: U$1.31 26.12,22.56 27.18,23.62 27.18,24.13 26.67,24.64 26.67,25.15 27.43,25.91 28.19,25.91 29.97,24.13 30.99,24.13 R8.2 31.24,24.38 v31.24,25.4 31.75,25.91 v31.75,27.43 | v36.32,12.45 35.05,11.18 35.05,10.16 v34.04,9.14 | U$3.1 41.02,26.29 41.91,27.18 v41.91,28.45
  Bottom 0.305: JP1.12 30.48,3.3 31.75,4.57 31.75,6.86 v34.04,9.14 | v36.32,12.45 30.23,18.54 30.23,21.08 30.73,21.59 30.73,24.89 v31.24,25.4 | v41.91,28.45 32.77,28.45 v31.75,27.43
SCK_SIG  (via drill 0.33)
  Top 0.305: U$1.9 20.07,9.81 v20.07,9.65 | v18.29,7.87 22.1,4.06 34.54,4.06 35.56,5.08 ISP1.3
  Bottom 0.305: v20.07,9.65 v18.29,7.87
TXL_SIG  (via drill 0.33)
  Top 0.305: R5.2 13.58,22.86 16.76,22.86 18.54,24.64 20.57,24.64 v20.83,24.38 | U$1.22 30.48,15.49 29.21,16.76 26.92,16.76 v22.86,20.83
  Bottom 0.305: v20.83,24.38 23.11,22.1 23.11,21.08 v22.86,20.83